# EAGLE design IGauge+V.2.0 (EAGLE 6.5.0)
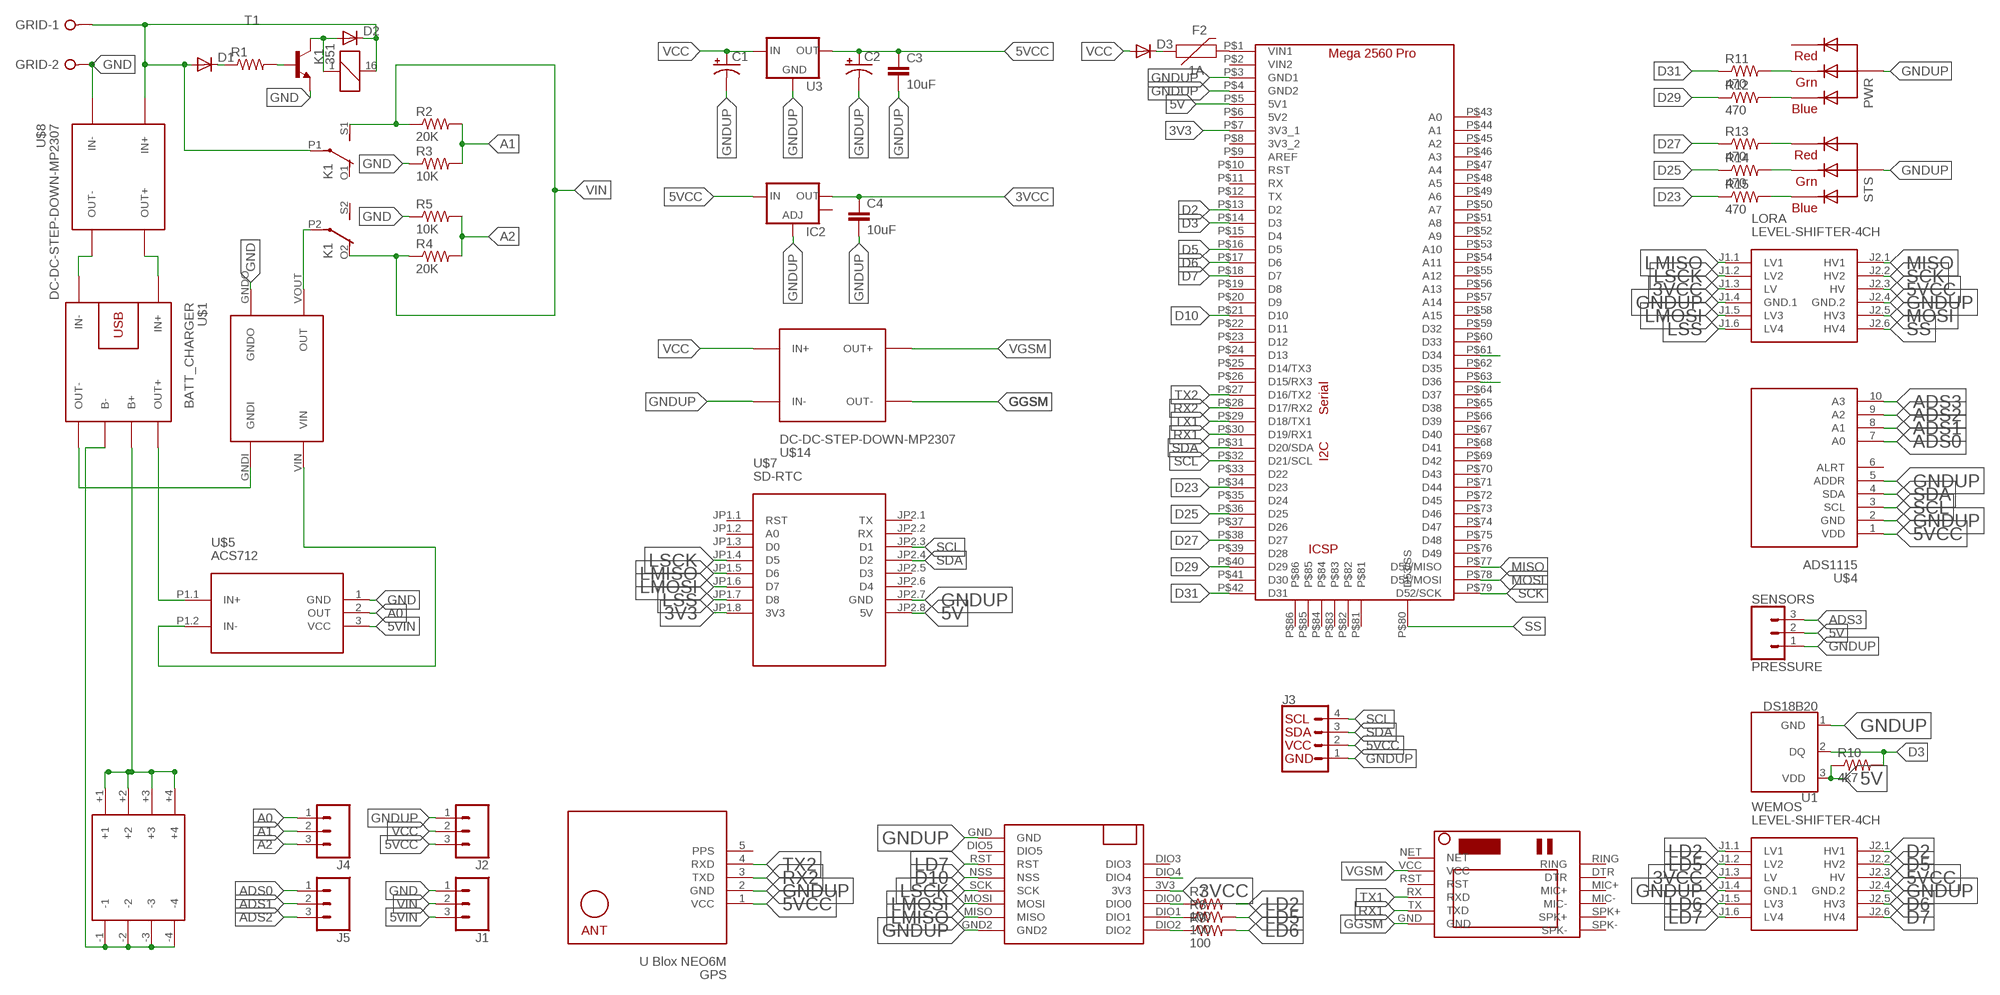
[diagram p0: schematic, sheet 1]

## Parts
C1  CPOL-USD  [PANASONIC_D]
C2  CPOL-USD  [PANASONIC_D]
C3  10uF  10UF-1206-6.3V-20%  [1206]
C4  10uF  10UF-1206-6.3V-20%  [1206]
D1  DIODE-SOD106A-R  [SOD106A-R]
D2  DIODE-SOD106A-R  [SOD106A-R]
D3  DIODE-SOD106A-R  [SOD106A-R]
F2  1A  PPTC_HALF-AMP  [1206]
GPS  U Blox NEO6M  GPS-RECEIVER-NEO6M  [GPS-RECEIVER-NEO6M]
GRID  W237-02P  [W237-132]
IC2  V_REG_LM1117SOT223  [SOT223]
J1  CONN_03  [1X03]
J2  CONN_03  [1X03]
J3  I2C_STANDARD  [1X04]
J4  CONN_03  [1X03]
J5  CONN_03  [1X03]
K1  351  [351]
LORA  LEVEL-SHIFTER-4CH  [LEVEL-SHIFTER-4CH]
PWR  RGBLED_CA-5MM  [LED5MMRGB]
R1  R-US_R1206  [R1206]
R2  20K  R-US_R1206  [R1206]
R3  10K  R-US_R1206  [R1206]
R4  20K  R-US_R1206  [R1206]
R5  10K  R-US_R1206  [R1206]
R7  100  R-US_M1406  [M1406]
R8  100  R-US_M1406  [M1406]
R9  100  R-US_M1406  [M1406]
R10  4k7  R-US_M1406  [M1406]
R11  470  R-US_R1206  [R1206]
R12  470  R-US_R1206  [R1206]
R13  470  R-US_R1206  [R1206]
R14  470  R-US_R1206  [R1206]
R15  470  R-US_R1206  [R1206]
SENSORS  PRESSURE  CONN_03POLAR  [MOLEX-1X3]
STS  RGBLED_CA-5MM  [LED5MMRGB]
T1  -NPN-SOT23-EBC  [SOT23-EBC]
U1  DS18B20  [TO-92-AMMO]
U3  V_REG_78XX-TO-220  [TO-220-ALT]
U$1  BATT_CHARGER  BATTERY-CHARGER-LI-PROT  [BATTERY-CHARGER-LI-PROT]
U$2  MT360_STEPUP  [MT360_STEPUP]
U$3  MEGAPROMINI  [MEGAPROMINI]
U$4  ADS1115  ADC-4CH-ADS1115  [ADC-4CH-ADS1115]
U$5  ACS712  CURRENT-SENSOR-ACS712#IC  [CURRENT-SENSOR-ACS712#IC]
U$6  LORA915MHZ  [LORA915MHZ]
U$7  SD-RTC  WEMOS-D1-MINI-SHIELD  [WEMOS-D1-MINI-SHIELD]
U$8  DC-DC-STEP-DOWN-MP2307  [DC-DC-STEP-DOWN-MP2307]
U$9  18650_4PCS_BATTERY_HOLDER  [18650_4PCS_BATTERY_HOLDER]
U$10  SIM800LMODULE  [SIM800LMODULE]
U$14  DC-DC-STEP-DOWN-MP2307  [DC-DC-STEP-DOWN-MP2307]
WEMOS  LEVEL-SHIFTER-4CH  [LEVEL-SHIFTER-4CH]

## Nets
3V3: U$3.P$7(3V3_1) U$7.JP1.8(3V3)
3VCC: C4.1 IC2.2(OUT) LORA.J1.3(LV) U$6.3V3 WEMOS.J1.3(LV)
5V: R10.1 SENSORS.2 U1.3(VDD) U$3.P$5(5V1) U$7.JP2.8(5V)
5VCC: C2.+ C3.1 GPS.1(VCC) IC2.3(IN) J2.3 J3.2 LORA.J2.3(HV) U3.OUT U$4.1(VDD) WEMOS.J2.3(HV)
5VIN: J1.3 U$5.3(VCC)
A0: J4.1 U$5.2(OUT)
A1: J4.2 R2.2 R3.2
A2: J4.3 R4.2 R5.2
ADS0: J5.1 U$4.7(A0)
ADS1: J5.2 U$4.8(A1)
ADS2: J5.3 U$4.9(A2)
ADS3: SENSORS.3 U$4.10(A3)
D2: U$3.P$13(D2) WEMOS.J2.1(HV1)
D3: R10.2 U1.2(DQ) U$3.P$14(D3)
D5: U$3.P$16(D5) WEMOS.J2.2(HV2)
D6: U$3.P$17(D6) WEMOS.J2.5(HV3)
D7: U$3.P$18(D7) WEMOS.J2.6(HV4)
D10: U$3.P$21(D10) U$6.NSS
D23: R15.1 U$3.P$34(D23)
D25: R14.1 U$3.P$36(D25)
D27: R13.1 U$3.P$38(D27)
D29: R12.1 U$3.P$40(D29)
D31: R11.1 U$3.P$42(D31)
D34: U$3.P$61(D34)
D36: U$3.P$63(D36)
GGSM: U$10.GND U$14.OUT-
GND: D1.A D2.C GRID.1 GRID.2 J1.1 K1.16 K1.P1(2:P) R3.1 R5.1 T1.E U$2.GNDO U$5.1(GND) U$8.IN+ U$8.IN-
GNDUP: C1.- C2.- C3.2 C4.2 GPS.2(GND) IC2.1(ADJ) J2.1 J3.1 LORA.J1.4(GND.1) LORA.J2.4(GND.2) PWR.2(VCC) SENSORS.1 STS.2(VCC) U1.1(GND) U3.GND U$1.IN- U$3.P$3(GND1) U$3.P$4(GND2) U$4.2(GND) U$4.5(ADDR) U$6.GND U$6.GND2 U$7.JP2.7(GND) U$8.OUT- U$14.IN- WEMOS.J1.4(GND.1) WEMOS.J2.4(GND.2)
LD2: R7.2 WEMOS.J1.1(LV1)
LD5: R8.2 WEMOS.J1.2(LV2)
LD6: R9.2 WEMOS.J1.5(LV3)
LD7: U$6.RST WEMOS.J1.6(LV4)
LMISO: LORA.J1.1(LV1) U$6.MISO U$7.JP1.5(D6)
LMOSI: LORA.J1.5(LV3) U$6.MOSI U$7.JP1.6(D7)
LSCK: LORA.J1.2(LV2) U$6.SCK U$7.JP1.4(D5)
LSS: LORA.J1.6(LV4) U$7.JP1.7(D8)
MISO: LORA.J2.1(HV1) U$3.P$77(D50/MISO)
MOSI: LORA.J2.5(HV3) U$3.P$78(D51/MOSI)
N$1: U$1.OUT- U$2.GNDI
N$2: D1.C R1.1
N$4: PWR.3(GREEN) R11.2
N$5: F2.2 U$3.P$1(VIN1)
N$6: D3.C F2.1
N$7: U$1.OUT+ U$5.P1.1(IN+)
N$9: U$1.IN+ U$8.OUT+
N$12: PWR.4(BLUE) R12.2
N$13: R13.2 STS.1(RED)
N$14: R1.2 T1.B
N$15: D2.A K1.1 T1.C
N$16: U$1.B+ U$9.+1 U$9.+2 U$9.+3 U$9.+4
N$17: U$1.B- U$9.-1 U$9.-2 U$9.-3 U$9.-4
N$19: R14.2 STS.3(GREEN)
N$20: R15.2 STS.4(BLUE)
N$21: U$6.DIO4
N$22: K1.P2(3:P) U$2.VOUT(OUT)
N$23: R7.1 U$6.DIO0
N$24: R8.1 U$6.DIO1
N$25: R9.1 U$6.DIO2
RX1: U$3.P$30(D19/RX1) U$10.TX(TXD)
RX2: GPS.3(TXD) U$3.P$28(D17/RX2)
SCK: LORA.J2.2(HV2) U$3.P$79(D52/SCK)
SCL: J3.4 U$3.P$32(D21/SCL) U$4.3(SCL) U$7.JP2.3(D1)
SDA: J3.3 U$3.P$31(D20/SDA) U$4.4(SDA) U$7.JP2.4(D2)
SS: LORA.J2.6(HV4) U$3.P$80(D53/SS)
TX1: U$3.P$29(D18/TX1) U$10.RX(RXD)
TX2: GPS.4(RXD) U$3.P$27(D16/TX2)
VCC: C1.+ D3.A J2.2 U3.IN U$14.IN+
VCCIN: U$2.VIN U$5.P1.2(IN-)
VGSM: U$10.VCC U$14.OUT+
VIN: J1.2 K1.O2(3:O) K1.S1(2:S) R2.1 R4.1
Unconnected: IC2.4(OUT) K1.O1(2:O) K1.S2(3:S) PWR.1(RED) U$3.P$2(VIN2) U$3.P$6(5V2) U$3.P$8(3V3_2) U$3.P$9(AREF) U$3.P$10(RST) U$3.P$11(RX) U$3.P$12(TX) U$3.P$15(D4) U$3.P$19(D8) U$3.P$20(D9) U$3.P$22(D11) U$3.P$23(D12) U$3.P$24(D13) U$3.P$25(D14/TX3) U$3.P$26(D15/RX3) U$3.P$33(D22) U$3.P$35(D24) U$3.P$37(D26) U$3.P$39(D28) U$3.P$41(D30) U$3.P$43(A0) U$3.P$44(A1) U$3.P$45(A2) U$3.P$46(A3) U$3.P$47(A4) U$3.P$48(A5) U$3.P$49(A6) U$3.P$50(A7) U$3.P$51(A8) U$3.P$52(A9) U$3.P$53(A10) U$3.P$54(A11) U$3.P$55(A12) U$3.P$56(A13) U$3.P$57(A14) U$3.P$58(A15) U$3.P$59(D32) U$3.P$60(D33) U$3.P$62(D35) U$3.P$64(D37) U$3.P$65(D38) U$3.P$66(D39) U$3.P$67(D40) U$3.P$68(D41) U$3.P$69(D42) U$3.P$70(D43) U$3.P$71(D44) U$3.P$72(D45) U$3.P$73(D46) U$3.P$74(D47) U$3.P$75(D48) U$3.P$76(D49) U$3.P$81 U$3.P$82 U$3.P$83 U$3.P$84 U$3.P$85 U$3.P$86 U$4.6(ALRT) U$6.DIO3 U$6.DIO5 U$7.JP1.1(RST) U$7.JP1.2(A0) U$7.JP1.3(D0) U$7.JP2.1(TX) U$7.JP2.2(RX) U$7.JP2.5(D3) U$7.JP2.6(D4) U$10.DTR U$10.MIC+ U$10.MIC- U$10.NET U$10.RING U$10.RST U$10.SPK+ U$10.SPK-

## Power pins joined to a net without a drawn wire
PPS: GPS.5(PPS)

## Library data of the parts
C1 C2 = resistor:CPOL-US: POLARIZED CAPACITOR, American symbol
C3 C4 = SparkFun-Capacitors:10UF: 10.0µF ceramic capacitors A capacitor is a passive two-terminal electrical component used to store electrical energy temporarily in an electric field.; PROD_ID: CAP-10057
D1-D3 = diode:DIODE-: DIODE
F2 = SparkFun-Fuses:PPTC: Resettable Fuse PPTC Resettable Fuse. Really a sort of resistor with a polymeric positive temperature coefficient whose resistance increases dramatically with an increase in temperature. When heated by the power passing through the resistance rises causing the current to be limited, protecting the circuit. This is achieved by the transition of the polymer from a crystalline to an amorphous state where the conductive carbon separates breaking the conductive pathways found in the cool crystalline structure. When a PPTC cools back down it resumes conducting letting the circuit turn back on. SparkFun Products: SparkFun RedBoard - Programmed with Arduino <https://www.sparkfun.com/products/12757> Pro Micro - 5V/16MHz <https://www.sparkfun.com/products/12640> Arduino Pro 328 - 5V/16MHz <https://www.sparkfun.com/products/10915> MP3 Trigger <https://www.sparkfun.com/products/13720>; PROD_ID: RES-08585; VALUE: 6V/0.5A
GPS = diy-modules:GPS-RECEIVER-NEO6M: GPS Receiver Module based on NEO-6 device Short tutorial how to use NEO-6 module with Arduino: http://www.xarg.org/2016/06/neo6mv2-gps-module-with-arduino/ NEO-6 datasheet is available here: https://www.u-blox.com/sites/default/files/products/documents/NEO-6_DataSheet_%28GPS.G6-HW-09005%29.pdf Click here to find device on ebay.com <http://www.ebay.com/sch/gyneo6mv2>
GRID = con-wago-508:W237-02P: WAGO SREW CLAMP; OC_FARNELL: unknown; OC_NEWARK: unknown
IC2 = SparkFun-3-2-07:V_REG_LM1117: Voltage Regulator LM1117 Standard adjustable voltage regulator but in SMD form. Spark Fun Electronics SKU : IC-LM1117
J1 J2 J4 J5 = SparkFun-Connectors:CONN_03: Multi connection point. Often used as Generic Header-pin footprint for 0.1 inch spaced/style header connections On any of the 0.1 inch spaced packages, you can populate with these: Break Away Headers - Straight <https://www.sparkfun.com/products/116> (PRT-00116) Break Away Male Headers - Right Angle <https://www.sparkfun.com/products/553> (PRT-00553) Female Headers <https://www.sparkfun.com/products/115> (PRT-00115) Break Away Headers - Machine Pin <https://www.sparkfun.com/products/117> (PRT-00117) Break Away Female Headers - Swiss Machine Pin <https://www.sparkfun.com/products/743> (PRT-00743) Stackable Header - 3 Pin (Female, 0.1") <https://www.sparkfun.com/products/13875> (PRT-13875) For SCREWTERMINALS and SPRING TERMINALS visit here: Screw Terimnals on SparkFun.com <https://www.sparkfun.com/search/results?term=Screw+Terminals> (5mm/3.5mm/2.54mm spacing) This device is also useful as a general connection point to wire up your design to another part of your project. Our various solder wires solder well into these plated through hole pads. Hook-Up Wire - Assortment (Stranded, 22 AWG) <https://www.sparkfun.com/products/11375> (PRT-11375) Hook-Up Wire - Assortment (Solid Core, 22 AWG) <https://www.sparkfun.com/products/11367> (PRT-11367) View the entire wire category on our website here <https://www.sparkfun.com/categories/141> Special notes: Molex polarized connector foot print use with SKU : PRT-08232 with associated crimp pins and housings.
J3 = SparkFun-Connectors:I2C_STANDARD: SparkFun I2C Standard Pinout Header SparkFun has standardized on a pinout for all I2C based sensor breakouts. This pinout allows I2C boards to be plugged directly into the headers on Arduino Uno compatible boards, and to be daisy chained easily. Example SparkFun Products: SparkFun Atmospheric Sensor Breakout - BME280 <https://www.sparkfun.com/products/13676> SparkFun Altitude/Pressure Sensor Breakout - MPL3115A2 <https://www.sparkfun.com/products/11084> SparkFun TOF Range Finder Sensor - VL6180 <https://www.sparkfun.com/products/12785>
K1 = relay:351: RELAY 2 x switch, Omron; OC_FARNELL: unknown; OC_NEWARK: unknown
LORA WEMOS = diy-modules:LEVEL-SHIFTER-4CH: 4-Channel Bi-Directional Logic Level Converter based on BSS128 transistors Click here to find device on ebay.com <http://www.ebay.com/sch/i2c+logic+converter+module>
PWR STS = adafruit:RGBLED_CA: RGB LED, common-anode 5MM Staggered pins 5mm Piranha package http://www.ladyada.net/library/pcb/eaglelibrary.html
R1-R5 R11-R15 = resistor:R-US_: RESISTOR, American symbol
R7-R10 = adafruit:R-US_: RESISTOR, American symbol
SENSORS = SparkFun-Connectors:CONN_03: Multi connection point. Often used as Generic Header-pin footprint for 0.1 inch spaced/style header connections On any of the 0.1 inch spaced packages, you can populate with these: Break Away Headers - Straight <https://www.sparkfun.com/products/116> (PRT-00116) Break Away Male Headers - Right Angle <https://www.sparkfun.com/products/553> (PRT-00553) Female Headers <https://www.sparkfun.com/products/115> (PRT-00115) Break Away Headers - Machine Pin <https://www.sparkfun.com/products/117> (PRT-00117) Break Away Female Headers - Swiss Machine Pin <https://www.sparkfun.com/products/743> (PRT-00743) Stackable Header - 3 Pin (Female, 0.1") <https://www.sparkfun.com/products/13875> (PRT-13875) For SCREWTERMINALS and SPRING TERMINALS visit here: Screw Terimnals on SparkFun.com <https://www.sparkfun.com/search/results?term=Screw+Terminals> (5mm/3.5mm/2.54mm spacing) This device is also useful as a general connection point to wire up your design to another part of your project. Our various solder wires solder well into these plated through hole pads. Hook-Up Wire - Assortment (Stranded, 22 AWG) <https://www.sparkfun.com/products/11375> (PRT-11375) Hook-Up Wire - Assortment (Solid Core, 22 AWG) <https://www.sparkfun.com/products/11367> (PRT-11367) View the entire wire category on our website here <https://www.sparkfun.com/categories/141> Special notes: Molex polarized connector foot print use with SKU : PRT-08232 with associated crimp pins and housings.; PROD_ID: CONN-08625; SF_ID: PRT-08096
T1 = transistor:*-NPN-: NPN Transistror BF959 corrected 2008.03.06
U1 = SparkFun-Sensors:DS18B20: Dallas/Maxim DS18B20 1-Wire Temperature Sensor The DS18B20 reports degrees C with 9 to 12-bit precision, -55C to 125C (+/-0.5C). Each sensor has a unique 64-Bit Serial number etched into it - allows for a huge number of sensors to be used on one data bus. Datasheet <http://datasheets.maximintegrated.com/en/ds/DS18B20.pdf> SparkFun Products One Wire Digital Temperature Sensor - DS18B20 <https://www.sparkfun.com/products/245> (SEN-00245); STORE_ID: SEN-00245
U3 = SparkFun-IC-Power:V_REG_78XX: Voltage Regulator Standard 78xx regulator. IGO (Input Ground Output). Spark Fun Electronics SKU : COM-00107; PROD_ID: VREG-08450; SF_ID: COM-00107
U$1 = diy-modules:BATTERY-CHARGER-LI-PROT: Lithium Battery 5V Charger with protection circuit More details available here: http://www.instructables.com/id/DIY-Lithium-ion-Battery-Charger/step4/TP4056-based-lithium-ion-battery-charger-module/ Click here to find device on ebay.com <http://www.ebay.com/sch/tp4056+charger+usb+protection>
U$2 = MT360_STEPUP:MT360_STEPUP
U$3 = MEGAPROMINI:MEGAPROMINI
U$4 = diy-modules:ADC-4CH-ADS1115: 4 Channel 16-Bit Analog-to-Digital Converter based on ADS1115 chip Arduino ADS1115 Getting Started Tutorial is available here: http://henrysbench.capnfatz.com/henrys-bench/arduino-voltage-measurements/arduino-ads1115-module-getting-started-tutorial/ ADS1115 datasheet is available here: http://www.ti.com/lit/ds/symlink/ads1115.pdf Click here to find device on ebay.com <http://www.ebay.com/sch/ads1115+module>
U$5 = diy-modules:CURRENT-SENSOR-ACS712#IC: Isolated Bipolar Current Sensors based on ACS712 chip Symbol with input pins More details available here: http://embedded-lab.com/blog/a-brief-overview-of-allegro-acs712-current-sensor-part-1/ Click here to find device on ebay.com <http://www.ebay.com/sch/acs712+module> Note: There are many available versions with different pinout. Please check before use
U$6 = LORA915MHZ:LORA915MHZ
U$7 = diy-modules:WEMOS-D1-MINI-SHIELD: Template for WEMOS D1 mini compatible shields NOTICE: This is a template only. You can use it as a base to create symbols for WEMOS D1 mini compatible shields. Official list of available shields can be found here: https://www.wemos.cc/D1-mini-Shields
U$8 U$14 = diy-modules:DC-DC-STEP-DOWN-MP2307: DC/DC Step-Down Regulator based on MP2307DN chip MP2307 datasheet available here: https://cdn-shop.adafruit.com/datasheets/MP2307_r1.9.pdf Click here to find device on ebay.com <http://www.ebay.com/sch/dc+dc+3a+mini+converter>
U$9 = 18650-Battery-Holder:18650_4PCS_BATTERY_HOLDER
U$10 = SIM800LMODULE:SIM800LMODULE: SIM800L Module

## Board
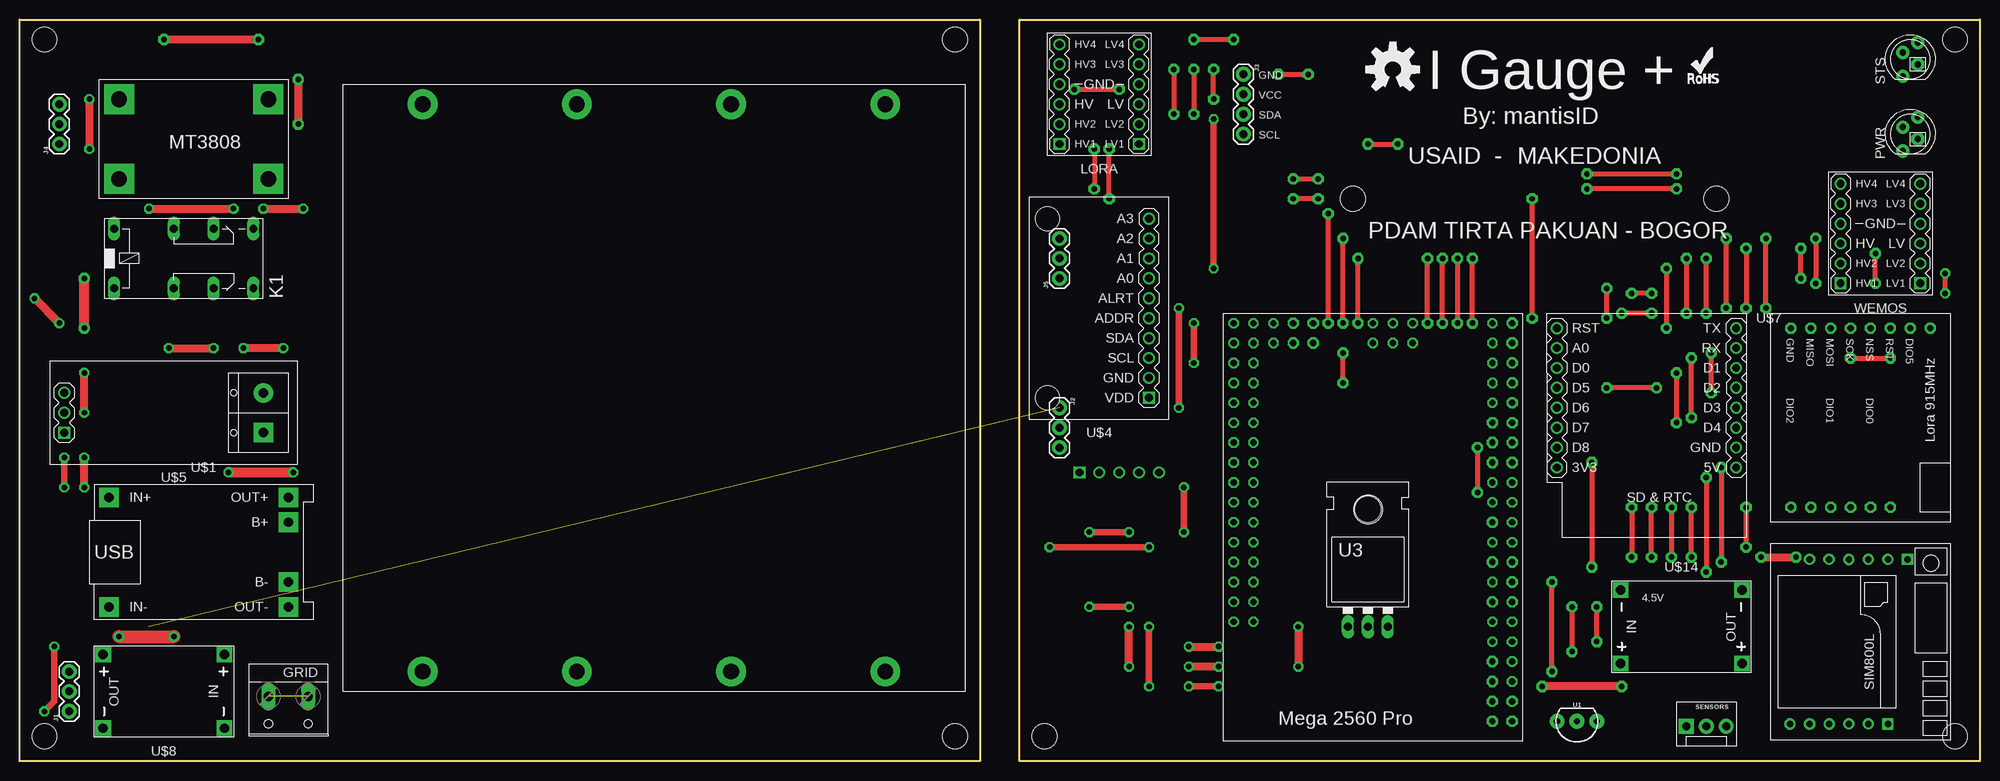
[diagram p1: board, top side]
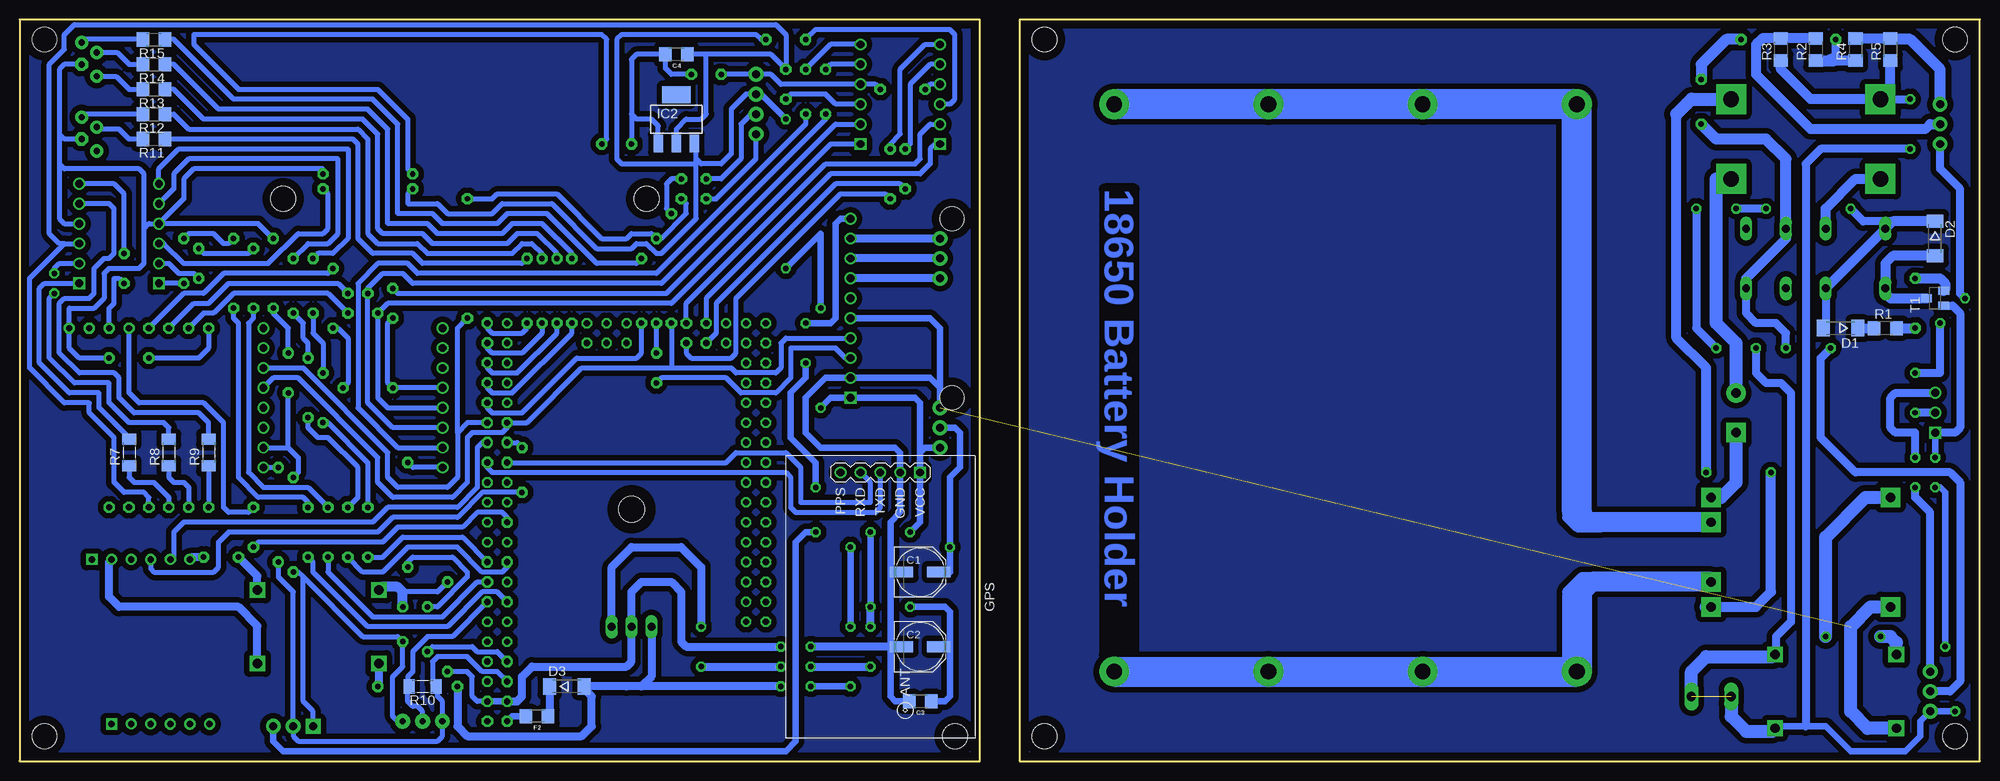
[diagram p2: board, bottom side, seen from below]

Size 250.19 x 94.62 mm. Coordinates in mm from the lower left corner, seen from the top.
Outline: 122.56,94.62 122.56,0 0,0 0,94.62 122.56,94.62
Outline: 127.64,0 127.64,94.62 250.19,94.62 250.19,0 127.64,0
Copper layers (1*16): Top 0.035mm / dielectric 1.5mm / Bottom 0.035mm
Design rules "default *": minimum track width 10mil, minimum drill 24mil, track to track 28mil, track to pad 28mil, pad to pad 28mil, via to via 28mil, smd to smd 28mil, copper to edge 40mil, drill to drill 8mil, minimum pad ring 10mil, minimum via ring 8mil, stop-mask expansion 4mil, vias tented up to drill 0mil, thermal gap 10mil
Holes 3.2 mm at 247.01,3.17 130.81,3.17 216.53,71.76 170.18,71.76 3.17,3.17 119.38,3.17 119.38,92.08 3.17,92.08 247.01,92.08

### Footprints (pad centres in the part's own frame; a part is rotated, then mirrored left to right if it is on the bottom)
PANASONIC_D = smd 3 x 1.4: + 2.4,0; - -2.4,0
1206 = smd 1.6 x 1.8: 1 -1.4,0; 2 1.4,0
SOD106A-R = smd 1.7 x 2.1: A 2.2,0; C -2.2,0
GPS-RECEIVER-NEO6M = drill 1 square: 1 -15.875,5.08 | drill 1: 2 -15.875,2.54; 3 -15.875,0; 4 -15.875,-2.54; 5 -15.875,-5.08
W237-132 = drill 1.194 long: 1 -2.54,-0.635; 2 2.54,-0.635
SOT223 = smd 1.219 x 2.235: 1 -2.311,-3.099; 2 0,-3.099; 3 2.311,-3.099 | smd 3.6 x 2.2: 4 0,3.099
1X03 = drill 1.016 pad 1.88: 1 0,0; 2 2.54,0; 3 5.08,0
1X04 = drill 1.016 pad 1.88: 1 0,0; 2 2.54,0; 3 5.08,0; 4 7.62,0
351 = drill 1.016 long: 1 -3.81,-3.81; 16 -3.81,3.81; O1 8.89,-3.81; O2 8.89,3.81; P1 3.81,-3.81; P2 3.81,3.81; S1 13.97,-3.81; S2 13.97,3.81
LEVEL-SHIFTER-4CH = drill 1 square: J1.1 -5.08,6.35; J2.1 5.08,6.35 | drill 1: J1.2 -5.08,3.81; J1.3 -5.08,1.27; J1.4 -5.08,-1.27; J1.5 -5.08,-3.81; J1.6 -5.08,-6.35; J2.2 5.08,3.81; J2.3 5.08,1.27; J2.4 5.08,-1.27; J2.5 5.08,-3.81; J2.6 5.08,-6.35
LED5MMRGB = drill 0.8 pad 1.676: 1 -2.159,0.968; 3 0.889,0.968; 4 2.159,-0.968 | drill 0.8 pad 1.676 octagon: 2 -0.635,-0.968
R1206 = smd 1.6 x 1.803: 1 -1.422,0; 2 1.422,0
M1406 = smd 1.4 x 1.8: 1 -1.7,0; 2 1.7,0
MOLEX-1X3 = drill 1.016 pad 1.88 square: 1 0,0 | drill 1.016 pad 1.88: 2 2.54,0; 3 5.08,0
SOT23-EBC = smd 1 x 1.4: B 0.95,-1.1; C 0,1.1; E -0.95,-1.1
TO-92-AMMO = drill 0.813 pad 1.88: 1 -2.54,0; 2 0,0; 3 2.54,0
TO-220-ALT = drill 1.016 long: GND 0,-3.81; IN -2.54,-3.81; OUT 2.54,-3.81 | hole 3.302: 0,11.176
BATTERY-CHARGER-LI-PROT = drill 1.2 pad 2.5 square: B+ 10.795,3.81; B- 10.795,-3.81; IN+ -12.065,6.985; IN- -12.065,-6.985; OUT+ 10.795,6.985; OUT- 10.795,-6.985
MT360_STEPUP = drill 2 pad 3.81 square: GNDI 3.81,-2.54; GNDO 3.81,-21.59; VIN 13.97,-2.54; VOUT 13.97,-21.59
MEGAPROMINI = drill 0.8 octagon: P$1 3.81,-2.54; P$2 1.27,-2.54; P$3 3.81,-5.08; P$4 1.27,-5.08; P$5 3.81,-7.62; P$6 1.27,-7.62; P$7 3.81,-10.16; P$8 1.27,-10.16; P$9 3.81,-12.7; P$10 1.27,-12.7; P$11 3.81,-15.24; P$12 1.27,-15.24; P$13 3.81,-17.78; P$14 1.27,-17.78; P$15 3.81,-20.32; P$16 1.27,-20.32; P$17 3.81,-22.86; P$18 1.27,-22.86; P$19 3.81,-25.4; P$20 1.27,-25.4; P$21 3.81,-27.94; P$22 1.27,-27.94; P$23 3.81,-30.48; P$24 1.27,-30.48; P$25 3.81,-33.02; P$26 1.27,-33.02; P$27 3.81,-35.56; P$28 1.27,-35.56; P$29 3.81,-38.1; P$30 1.27,-38.1; P$31 3.81,-40.64; P$32 1.27,-40.64; P$33 3.81,-43.18; P$34 1.27,-43.18; P$35 3.81,-45.72; P$36 1.27,-45.72; P$37 3.81,-48.26; P$38 1.27,-48.26; P$39 3.81,-50.8; P$40 1.27,-50.8; P$41 3.81,-53.34; P$42 1.27,-53.34; P$43 36.83,-15.24; P$44 34.29,-15.24; P$45 36.83,-17.78; P$46 34.29,-17.78; P$47 36.83,-20.32; P$48 34.29,-20.32; P$49 36.83,-22.86; P$50 34.29,-22.86; P$51 36.83,-25.4; P$52 34.29,-25.4; P$53 36.83,-27.94; P$54 34.29,-27.94; P$55 36.83,-30.48; P$56 34.29,-30.48; P$57 36.83,-33.02; P$58 34.29,-33.02; P$59 36.83,-35.56; P$60 34.29,-35.56; P$61 36.83,-38.1; P$62 34.29,-38.1; P$63 36.83,-40.64; P$64 34.29,-40.64; P$65 36.83,-43.18; P$66 34.29,-43.18; P$67 36.83,-45.72; P$68 34.29,-45.72; P$69 36.83,-48.26; P$70 34.29,-48.26; P$71 36.83,-50.8; P$72 34.29,-50.8; P$73 36.83,-53.34; P$74 34.29,-53.34; P$75 31.75,-53.34; P$76 31.75,-50.8; P$77 29.21,-53.34; P$78 29.21,-50.8; P$79 26.67,-53.34; P$80 26.67,-50.8; P$81 19.05,-53.34; P$82 19.05,-50.8; P$83 16.51,-53.34; P$84 16.51,-50.8; P$85 13.97,-53.34; P$86 13.97,-50.8
ADC-4CH-ADS1115 = drill 1 square: 1 -6.35,11.43 | drill 1: 2 -6.35,8.89; 3 -6.35,6.35; 4 -6.35,3.81; 5 -6.35,1.27; 6 -6.35,-1.27; 7 -6.35,-3.81; 8 -6.35,-6.35; 9 -6.35,-8.89; 10 -6.35,-11.43 | hole 3.1: 6.604,11.43; 6.604,-11.43
CURRENT-SENSOR-ACS712#IC = drill 1 square: 1 13.97,2.54 | drill 1: 2 13.97,0; 3 13.97,-2.54 | drill 1.2 pad 2.5 square: P1.1 -11.43,2.54 | drill 1.2 pad 2.5: P1.2 -11.43,-2.54
LORA915MHZ = drill 0.8 octagon: 3V3 24.765,-12.7; DIO0 24.765,-15.24; DIO1 24.765,-17.78; DIO2 24.765,-20.32; DIO3 24.765,-7.62; DIO4 24.765,-10.16; DIO5 1.905,-5.08; GND 1.905,-2.54; GND2 1.905,-20.32; MISO 1.905,-17.78; MOSI 1.905,-15.24; NSS 1.905,-10.16; RST 1.905,-7.62; SCK 1.905,-12.7
WEMOS-D1-MINI-SHIELD = drill 1: JP1.1 -11.43,12.065; JP1.2 -11.43,9.525; JP1.3 -11.43,6.985; JP1.4 -11.43,4.445; JP1.5 -11.43,1.905; JP1.6 -11.43,-0.635; JP1.7 -11.43,-3.175; JP1.8 -11.43,-5.715; JP2.1 11.43,12.065; JP2.2 11.43,9.525; JP2.3 11.43,6.985; JP2.4 11.43,4.445; JP2.5 11.43,1.905; JP2.6 11.43,-0.635; JP2.7 11.43,-3.175; JP2.8 11.43,-5.715
DC-DC-STEP-DOWN-MP2307 = drill 1.2 pad 2 square: IN+ -7.747,-4.699; IN- -7.747,4.699; OUT+ 7.747,-4.699; OUT- 7.747,4.699
18650_4PCS_BATTERY_HOLDER = drill 2 pad 3.81: +1 10.16,74.93; +2 29.845,74.93; +3 49.53,74.93; +4 69.215,74.93; -1 10.16,2.54; -2 29.845,2.54; -3 49.53,2.54; -4 69.215,2.54
SIM800LMODULE = drill 0.8: DTR 10.5,1; GND -10.5,-6.5; MIC+ 10.5,-1.5; MIC- 10.5,-4; RST -10.5,1; RX -10.5,-1.5; SPK+ 10.5,-6.5; SPK- 10.5,-9; TX -10.5,-4; VCC -10.5,3.5 | drill 0.8 square: NET -10.5,6; RING 10.5,3.5

### Placement (x,y rotation side)
C1  135.25,24.13 0 bottom
C2  135.25,14.61 0 bottom
C3  135.25,7.62 180 bottom
C4  166.37,90.17 180 bottom
D1  17.78,55.24 180 bottom
D2  5.72,66.68 270 bottom
D3  180.34,9.53 0 bottom
F2  184.15,5.71 180 bottom
GPS  140.34,20.96 270 bottom
GRID  34.29,7.62 180 top
IC2  166.37,81.92 0 bottom
J1  6.35,6.35 90 top
J2  132.72,45.09 270 top
J3  156.21,87.63 270 top
J4  5.08,78.74 90 top
J5  132.72,61.59 90 top
K1  15.88,64.14 0 top
LORA  137.8,85.09 180 top
PWR  241.3,80.01 90 top
R1  12.06,55.24 0 bottom
R2  20.95,90.81 90 bottom
R3  25.4,90.81 90 bottom
R4  15.88,90.81 90 bottom
R5  11.43,90.81 90 bottom
R7  236.22,39.37 90 bottom
R8  231.14,39.37 90 bottom
R9  226.06,39.37 90 bottom
R10  198.75,9.53 180 bottom
R11  233.05,79.38 180 bottom
R12  233.05,82.55 180 bottom
R13  233.05,85.73 180 bottom
R14  233.05,88.9 180 bottom
R15  233.05,92.08 180 bottom
SENSORS  212.72,4.45 0 top
STS  241.3,89.54 90 top
T1  5.72,59.05 90 bottom
U1  198.75,5.08 180 top
U3  172.08,20.96 0 top
U$1  23.5,26.67 0 top
U$2  34.29,88.27 270 top
U$3  191.77,2.54 180 top
U$4  137.8,57.78 180 top
U$5  19.69,44.45 180 top
U$6  246.38,57.15 270 top
U$7  207.64,43.18 0 top
U$8  18.42,8.89 180 top
U$9  41.27,8.89 0 top
U$10  234.95,15.24 270 top
U$12  [OSHW-LOGO-L]  175.26,88.27 0 top
U$13  [ROHS_LOGO_0.18_IN]  212.72,86.36 0 top
U$14  212.09,17.15 0 top
WEMOS  237.49,67.31 180 top

### Tracks (layer width: path | path; a pad name or v marks a point on that pad's centre or on a via)
3V3  (via drill 0.7 pad 1.42)
  Top 0.61: v200.66,38.1 v200.66,24.77 | v198.12,19.69 v198.12,13.97
  Bottom 0.61: U$7.JP1.8 200.03,37.46 v200.66,38.1 | v200.66,24.77 200.66,25.4 200.03,26.04 194.94,26.04 193.04,24.13 193.04,23.5 196.85,19.69 v198.12,19.69 | v198.12,13.97 197.49,14.61 192.41,14.61 191.77,13.97 189.23,13.97 U$3.P$7
3VCC  (via drill 0.7 pad 1.42)
  Top 0.61: v152.4,84.45 v152.4,88.27
  Bottom 0.61: LORA.J1.3 146.05,83.82 147.32,85.09 151.76,85.09 v152.4,84.45 | IC2.2 166.37,80.65 165.1,81.92 163.19,81.92 162.56,82.55 162.56,90.17 | U$6.3V3 233.68,33.66 234.31,34.29 236.86,34.29 238.12,35.56 238.12,41.27 241.3,44.45 241.3,45.72 244.48,45.72 248.92,50.16 248.92,61.59 244.48,66.04 | 162.56,90.17 154.31,90.17 v152.4,88.27 152.4,92.71 153.67,93.98 243.2,93.98 244.48,92.71 244.48,90.81 246.38,88.9 246.38,67.31 245.11,66.04 244.48,66.04 | 162.56,90.17 C4.1 | 244.48,66.04 WEMOS.J1.3
5V  (via drill 0.7 pad 1.42)
  Top 0.61: v217.17,37.46 v217.17,25.4
  Bottom 0.61: U$7.JP2.8 v217.17,37.46 | v217.17,25.4 217.17,23.5 215.26,21.59 SENSORS.2 215.26,3.17 214.63,2.54 196.85,2.54 196.22,3.17 U1.3 196.22,7.62 196.85,8.26 196.85,9.32 R10.1 197.49,9.96 197.49,12.7 196.85,13.33 193.04,13.33 191.13,11.43 189.23,11.43 U$3.P$5
5VCC  (via drill 0.7 pad 1.27, 0.7 pad 1.42)
  Top 0.61: v211.45,73.03 v200.03,73.03 | v149.86,92.08 v154.94,92.08
  Top 0.813: v136.53,19.69 v141.61,19.69 | v141.61,29.21 v136.53,29.21 | v147.95,45.09 v147.95,57.78 | v152.4,62.86 v152.4,81.92
  Top 1.016: v163.19,17.15 v163.19,12.06 | v153.03,12.06 v149.22,12.06 | v141.61,12.06 v141.61,17.15
  Bottom 0.61: WEMOS.J2.3 231.78,66.04 229.24,63.5 218.44,63.5 214.63,67.31 211.45,67.31 210.82,67.95 210.82,72.39 v211.45,73.03 | v200.03,73.03 200.66,72.39 200.66,71.12 196.85,71.12 195.58,69.85 189.87,69.85 188.59,71.12 182.25,71.12 176.53,65.41 172.08,65.41 171.45,66.04 170.18,66.04 168.91,64.77 168.28,64.77 163.83,69.22 163.83,76.2 | 163.83,76.2 163.83,76.84 | 163.83,76.84 163.83,78.59 IC2.3 | v149.86,92.08 148.59,93.34 131.44,93.34 130.81,92.71 130.81,84.45 131.44,83.82 LORA.J2.3 | v154.94,92.08 155.57,92.08 156.21,92.71 173.36,92.71 173.99,92.08 173.99,76.84 173.36,76.2 163.83,76.2 | J3.2 157.48,85.09 159.38,83.19 159.38,77.47 160.66,76.2 163.19,76.2 163.83,76.84
  Bottom 0.813: GPS.1 135.25,39.37 134.62,40 J2.3 | GPS.1 135.25,45.72 135.89,46.35 U$4.1 146.69,46.35 v147.95,45.09 | C2.+ 131.44,14.61 | 131.44,14.61 131.44,19.05 132.08,19.69 v136.53,19.69 | v141.61,19.69 v141.61,29.21 | v136.53,29.21 135.25,30.48 GPS.1 | C3.1 132.08,7.62 131.44,8.26 131.44,14.61 | v147.95,57.78 147.95,67.31 v152.4,62.86 | v152.4,81.92 155.57,85.09 J3.2
  Bottom 1.016: U3.OUT 174.62,24.77 172.08,27.31 165.74,27.31 163.19,24.77 v163.19,17.15 | v163.19,12.06 v153.03,12.06 | v149.22,12.06 v141.61,12.06 | v141.61,17.15 v141.61,19.69
5VIN  (via drill 0.7 pad 1.27)
  Top 1.016: v8.25,34.92 v8.25,38.73
  Bottom 1.016: J1.3 6.35,31.75 8.25,33.66 v8.25,34.92 | v8.25,38.73 8.25,41.91 10.8,41.91 11.43,42.54 11.43,46.35 10.8,46.99 U$5.3
A0  (via drill 0.7 pad 1.27)
  Top 1.016: v8.25,44.45 v8.25,49.53 | v5.08,55.88 v1.91,59.05
  Bottom 1.016: U$5.2 v8.25,44.45 | v8.25,49.53 5.08,49.53 v5.08,55.88 | v1.91,59.05 2.54,59.69 2.54,73.03 5.08,75.57 J4.1
A1
  Bottom 1.27: R3.2 R2.2 27.79,92.23 28.58,91.44 28.58,87.63 21.59,80.65 6.98,80.65 6.35,81.28 J4.2
A2
  Bottom 1.27: R4.2 R5.2
  Bottom 1.422: J4.3 5.08,88.27 8.89,92.08 11.28,92.08 R5.2
ADS0
  Bottom 1.016: J5.1 U$4.7
ADS1
  Bottom 1.016: J5.2 U$4.8
ADS2
  Bottom 1.016: J5.3 U$4.9
ADS3  (via drill 0.7 pad 1.27)
  Top 0.813: v148.59,29.21 v148.59,34.92 | v149.86,50.8 v149.86,55.88
  Bottom 0.813: v148.59,29.21 149.86,29.21 151.13,27.94 151.13,2.54 152.4,1.27 216.53,1.27 217.81,2.54 SENSORS.3 | v148.59,34.92 148.59,38.1 151.76,41.27 151.76,46.99 149.86,48.89 v149.86,50.8 | v149.86,55.88 146.69,55.88 146.05,56.52 146.05,68.58 145.41,69.22 U$4.10
D2  (via drill 0.7 pad 1.42)
  Top 0.61: v213.36,26.04 v213.36,32.38 | v222.88,57.78 v222.88,66.68 | v229.24,66.68 v229.24,60.96
  Bottom 0.61: U$3.P$13 189.23,21.59 191.13,21.59 195.58,17.15 205.74,17.15 212.72,24.13 212.72,25.4 v213.36,26.04 | v213.36,32.38 213.36,33.02 214,33.66 219.71,33.66 222.25,36.2 222.25,55.88 222.88,56.52 v222.88,57.78 | v222.88,66.68 223.52,66.04 224.16,66.04 225.43,67.31 228.6,67.31 v229.24,66.68 | v229.24,60.96 WEMOS.J2.1
D3
  Bottom 0.61: U1.2 198.75,6.35 199.39,6.98 200.03,6.98 200.66,7.62 200.66,9.32 R10.2 200.66,9.73 200.66,10.79 200.03,11.43 200.03,13.97 198.12,15.88 194.94,15.88 U$3.P$14
D5  (via drill 0.7 pad 1.42)
  Top 0.61: v227.33,61.59 v227.33,65.41 | v220.34,65.41 v220.34,57.78 | v210.82,32.38 v210.82,26.04
  Bottom 0.61: WEMOS.J2.2 231.14,63.5 229.87,62.23 227.97,62.23 v227.33,61.59 | v227.33,65.41 226.69,64.77 220.98,64.77 v220.34,65.41 | v220.34,57.78 220.34,56.52 220.98,55.88 220.98,36.83 219.07,34.92 213.36,34.92 v210.82,32.38 | v210.82,26.04 210.82,24.13 205.11,18.42 196.22,18.42 191.77,22.86 U$3.P$16
D6  (via drill 0.7 pad 1.42)
  Top 0.61: v208.28,26.04 v208.28,32.38 | v213.36,43.81 v213.36,51.43 | v215.26,57.15 v215.26,64.14
  Bottom 0.61: U$3.P$17 187.96,24.77 188.59,24.13 191.13,24.13 194.31,27.31 200.66,27.31 203.83,24.13 205.11,24.13 205.74,24.13 206.38,24.13 v208.28,26.04 | v208.28,32.38 207.01,33.66 207.01,37.46 210.82,41.27 212.09,41.27 213.36,42.54 v213.36,43.81 | v213.36,51.43 213.36,53.34 214,53.98 214,55.88 v215.26,57.15 | v215.26,64.14 213.36,66.04 210.82,66.04 209.55,67.31 209.55,76.84 228.6,76.84 230.5,74.93 230.5,73.03 WEMOS.J2.5
D7  (via drill 0.7 pad 1.42)
  Top 0.61: v212.72,64.14 v212.72,57.15 | v211.45,49.53 v211.45,43.18 | v205.74,32.38 v205.74,26.04
  Bottom 0.61: WEMOS.J2.6 232.41,75.57 229.87,78.11 208.28,78.11 208.28,66.68 210.19,64.77 212.09,64.77 v212.72,64.14 | v212.72,57.15 212.72,54.61 211.45,53.34 v211.45,49.53 | v211.45,43.18 210.82,43.18 205.74,38.1 v205.74,32.38 | v205.74,26.04 203.83,26.04 201.3,28.58 193.68,28.58 U$3.P$18
D10  (via drill 0.7 pad 1.42)
  Top 0.61: v220.34,27.31 v220.34,32.38
  Bottom 0.61: U$3.P$21 187.96,31.12 188.59,31.75 191.77,31.75 193.68,29.85 201.93,29.85 203.83,27.94 219.71,27.94 v220.34,27.31 | v220.34,32.38 220.98,31.75 223.52,31.75 224.16,32.38 224.16,43.18 226.69,45.72 234.95,45.72 236.22,46.99 U$6.NSS
D23  (via drill 0.7 pad 1.42)
  Top 0.61: v170.81,55.88 v170.81,64.14
  Bottom 0.61: U$3.P$34 190.5,45.09 189.87,44.45 186.06,44.45 179.07,51.43 171.45,51.43 170.81,52.07 v170.81,55.88 | v170.81,64.14 171.45,63.5 176.53,63.5 182.88,69.85 187.96,69.85 189.23,68.58 196.22,68.58 197.49,69.85 201.93,69.85 201.93,81.28 205.11,84.45 222.88,84.45 230.5,92.08 R15.1
D25  (via drill 0.7 pad 1.42)
  Top 0.61: v179.7,55.88 v179.7,64.14
  Bottom 0.61: U$3.P$36 190.5,47.62 189.87,46.99 187.32,46.99 179.7,54.61 v179.7,55.88 | v179.7,64.14 179.7,64.77 183.51,68.58 187.32,68.58 188.59,67.31 196.85,67.31 198.12,68.58 203.2,68.58 203.2,80.65 205.74,83.19 224.79,83.19 230.5,88.9 R14.1
D27  (via drill 0.7 pad 1.42)
  Top 0.61: v181.61,55.88 v181.61,64.14
  Bottom 0.61: U$3.P$38 190.5,50.16 189.87,49.53 186.69,49.53 181.61,54.61 v181.61,55.88 | v181.61,64.14 181.61,64.77 184.15,67.31 186.69,67.31 187.96,66.04 197.49,66.04 198.75,67.31 203.83,67.31 204.47,67.95 204.47,80.01 206.38,81.92 226.69,81.92 230.5,85.73 R13.1
D29  (via drill 0.7 pad 1.42)
  Top 0.61: v183.51,64.14 v183.51,55.88
  Bottom 0.61: R12.1 230.5,82.55 228.6,80.65 207.01,80.65 205.74,79.38 205.74,67.31 204.47,66.04 199.39,66.04 198.12,64.77 187.32,64.77 186.06,66.04 184.78,66.04 183.51,64.77 v183.51,64.14 | v183.51,55.88 183.51,54.61 186.06,52.07 189.87,52.07 190.5,52.7 U$3.P$40
D31  (via drill 0.7 pad 1.42)
  Top 0.61: v185.42,55.88 v185.42,64.14
  Bottom 0.61: U$3.P$42 190.5,55.24 189.87,54.61 186.06,54.61 185.42,55.24 v185.42,55.88 | v185.42,64.14 186.06,63.5 198.75,63.5 200.03,64.77 205.11,64.77 207.01,66.68 207.01,78.74 207.64,79.38 R11.1
GGSM  (via drill 0.7 pad 1.42)
  Top 1.016: v222.25,26.04 v226.69,26.04
  Bottom 1.016: U$14.OUT- 219.84,23.62 v222.25,26.04 | v226.69,26.04 228.16,26.04 U$10.GND
GND  (via drill 0.7 pad 1.27)  (1 unrouted)
  Top 0.813: v5.72,38.73 v5.72,34.92 | v4.45,14.61 4.45,7.62 v3.17,6.35
  Top 1.016: v8.89,84.45 v8.89,78.11 | v16.51,70.48 v27.31,70.48 | v31.11,70.48 v36.2,70.48 | v33.66,52.7 v28.58,52.7
  Bottom 0.813: U$8.IN- 25.91,4.45 22.22,4.45 19.69,4.45 16.51,1.27 9.53,1.27 7.62,3.17 7.62,5.08 J1.1 v3.17,6.35 | U$5.1 v5.72,38.73 | v5.72,34.92 5.08,34.92 4.45,34.29 v4.45,14.61
  Bottom 1.016: T1.E 3.5,58.1 2.54,57.15 2.54,42.54 3.17,41.91 U$5.1 | 12.06,84.45 v8.89,84.45 | K1.P1 19.69,55.54 D1.A | v8.89,78.11 20.32,78.11 22.22,76.2 22.22,4.45 | 11.14,68.88 14.9,68.88 v16.51,70.48 | v27.31,70.48 v31.11,70.48 | v36.2,70.48 36.2,55.24 v33.66,52.7 | v28.58,52.7 28.58,49.53 27.31,48.26 25.4,48.26 24.13,46.99 24.13,17.78 26.03,15.88 26.03,13.72 U$8.IN+
  Bottom 1.27: R5.1 11.43,85.09 12.06,84.45 U$2.GNDO 21.59,84.45 25.4,88.27 R3.1 | D2.C 11.14,68.88 K1.16 K1.P1
  Bottom 1.676: GRID.1 36.83,11.43 34.92,13.33 26.42,13.33 U$8.IN+ | GRID.2 31.75,5.71 29.84,3.81 26.54,3.81 U$8.IN-
GNDUP  (via drill 0.7 pad 1.27, 0.7 pad 1.42)  (1 unrouted)
  Top 0.61: v134.62,85.73 v140.34,85.73 | v160.66,87.63 v164.47,87.63 | v233.68,51.43 v238.76,51.43 | v215.26,36.2 v215.26,24.13 | v201.3,15.24 v201.3,19.69 | v215.9,46.99 v215.9,52.07 | v217.81,57.78 v217.81,66.68 | v172.08,78.74 v175.89,78.74 | v200.03,74.93 v211.45,74.93 | v195.58,11.43 v195.58,22.86
  Top 1.016: v149.22,14.61 v153.03,14.61
  Bottom 0.61: LORA.J2.4 133.99,86.36 v134.62,85.73 | v140.34,85.73 140.97,86.36 LORA.J1.4 153.03,86.36 154.31,87.63 J3.1 v160.66,87.63 | IC2.1 168.68,81.05 169.55,81.92 171.45,81.92 172.08,82.55 | v164.47,87.63 167,87.63 167.77,88.4 C4.2 171.45,90.17 172.08,89.54 172.08,82.55 | STS.2 244.48,88.9 245.11,88.27 245.11,80.01 | 234.31,67.95 234.31,63.5 234.95,62.86 238.76,62.86 239.39,62.23 239.39,59.05 240.67,57.78 243.84,57.78 U$6.GND 243.84,52.7 242.57,51.43 v238.76,51.43 | 234.31,67.95 233.68,68.58 WEMOS.J2.4 | PWR.2 244.48,79.38 245.11,80.01 | 245.11,80.01 245.11,76.2 | 245.11,76.2 245.11,69.22 244.48,68.58 WEMOS.J1.4 | 234.31,67.95 234.31,74.93 234.95,75.57 244.48,75.57 245.11,76.2 | U$6.GND2 226.06,52.7 227.33,51.43 v233.68,51.43 | v215.26,36.2 214.63,36.83 214.63,38.73 215.9,40 | v215.26,24.13 214.63,24.13 214,23.5 | 214,23.5 206.38,15.88 201.93,15.88 v201.3,15.24 201.3,12.06 202.56,10.79 202.56,5.71 201.93,5.08 U1.1 | SENSORS.1 212.72,6.35 214,7.62 214,23.5 | U$7.JP2.7 215.9,40 | 215.9,40 v215.9,46.99 | v215.9,52.07 215.9,55.24 217.81,57.15 v217.81,57.78 | v217.81,66.68 219.71,68.58 WEMOS.J2.4 | 172.08,82.55 v172.08,78.74 | v175.89,78.74 175.26,79.38 175.26,92.08 175.89,92.71 227.97,92.71 227.97,91.44 222.25,85.73 204.47,85.73 200.66,81.92 200.66,75.57 v200.03,74.93 | v211.45,74.93 211.45,75.57 227.97,75.57 229.24,74.3 229.24,71.76 WEMOS.J2.4 | U$3.P$4 191.77,7.62 192.41,8.26 192.41,10.79 193.04,11.43 v195.58,11.43 | v195.58,22.86 196.85,21.59 201.3,21.59
  Bottom 0.813: U$3.P$3 U$3.P$4 | 139.06,24.13 139.06,30.48 137.8,31.75 GPS.2 137.8,39.37 138.43,40 147.95,40 149.86,41.91 149.86,46.35 147.32,48.89 U$4.2 133.99,48.89 132.72,47.62 J2.1 132.72,55.24 133.99,56.52 U$4.5 | C1.- 139.06,24.13 | 139.06,24.13 139.06,14.61 | C2.- 139.06,14.61 | 139.06,14.61 139.06,8.26 138.43,7.62 C3.2
  Bottom 1.016: 139.06,14.61 v149.22,14.61 | v153.03,14.61 165.1,14.61 165.74,15.24 165.74,21.59 167,22.86 170.81,22.86 172.08,21.59 U3.GND 172.08,12.7 172.72,12.06 184.78,12.06 186.06,10.79 186.06,8.26 186.69,7.62 U$3.P$3
  Bottom 1.27: v201.3,19.69 201.3,21.59 201.93,22.23 203.96,22.23 U$14.IN-
  Bottom 1.676: U$8.OUT- 14.35,4.19 16.51,6.35 16.51,17.15 13.97,19.69 U$1.IN-
LD2
  Bottom 0.61: R7.2 236.22,41.27 240.03,45.09 240.03,46.99 243.84,46.99 247.65,50.8 247.65,60.32 247.01,60.96 WEMOS.J1.1
LD5  (via drill 0.7 pad 1.27)
  Top 0.61: v245.75,59.69 v245.75,62.23
  Bottom 0.61: R8.2 231.14,42.54 231.78,43.18 236.22,43.18 238.76,45.72 238.76,48.26 243.2,48.26 246.38,51.43 246.38,59.05 v245.75,59.69 | v245.75,62.23 245.75,62.86 245.11,63.5 WEMOS.J1.2
LD6
  Bottom 0.61: R9.2 226.06,43.18 227.33,44.45 235.58,44.45 237.49,46.35 237.49,48.89 238.12,49.53 242.57,49.53 245.11,52.07 245.11,58.42 244.48,59.05 241.3,59.05 240.67,59.69 240.67,62.86 239.39,64.14 238.76,64.14 238.12,64.77 238.12,70.48 238.76,71.12 WEMOS.J1.5
LD7  (via drill 0.7 pad 1.42)
  Top 0.61: v236.86,60.96 v236.86,64.77
  Bottom 0.61: U$6.RST 238.76,57.78 238.12,58.42 238.12,61.59 237.49,61.59 v236.86,60.96 | v236.86,64.77 236.86,72.39 238.12,73.66 WEMOS.J1.6
LMISO  (via drill 0.7 pad 1.42)
  Top 0.61: v208.28,57.15 v204.47,57.15
  Bottom 0.61: LORA.J1.1 146.69,78.74 167,58.42 203.2,58.42 v204.47,57.15 204.47,46.35 203.2,45.09 U$7.JP1.5 | v208.28,57.15 210.82,59.69 222.88,59.69 225.43,57.15 226.69,57.15 U$6.MISO
LMOSI  (via drill 0.7 pad 1.42)
  Top 0.61: v147.32,88.27 v147.32,82.55 | v208.28,59.69 v205.74,59.69
  Bottom 0.61: U$7.JP1.6 202.56,42.54 205.74,45.72 v205.74,59.69 205.74,60.32 203.83,62.23 201.3,62.23 200.03,60.96 168.28,60.96 147.32,81.92 v147.32,82.55 | LORA.J1.5 146.69,88.9 v147.32,88.27 | v208.28,59.69 209.55,60.96 223.52,60.96 226.06,58.42 227.97,58.42 U$6.MOSI
LSCK  (via drill 0.7 pad 1.42)
  Top 0.61: v202.56,56.52 v202.56,60.32 | v210.19,62.86 v210.19,55.24 | v208.92,47.62 v202.56,47.62
  Bottom 0.61: U$7.JP1.4 v202.56,47.62 203.2,48.26 203.2,55.88 v202.56,56.52 | v202.56,60.32 201.93,59.69 167.64,59.69 146.05,81.28 LORA.J1.2 | v210.19,62.86 210.82,62.23 224.16,62.23 226.69,59.69 229.24,59.69 U$6.SCK | v210.19,55.24 209.55,55.24 208.28,53.98 208.28,48.26 v208.92,47.62
LSS  (via drill 0.7 pad 1.42)
  Top 0.61: v149.86,88.27 v149.86,82.55
  Bottom 0.61: LORA.J1.6 146.69,91.44 v149.86,88.27 | v149.86,82.55 149.86,81.28 168.91,62.23 199.39,62.23 200.66,63.5 204.47,63.5 207.01,60.96 207.01,45.09 201.93,40 U$7.JP1.7
MISO
  Bottom 0.61: LORA.J2.1 133.35,78.74 133.99,78.11 133.99,76.2 135.25,74.93 146.69,74.93 162.56,59.05 U$3.P$77
MOSI  (via drill 0.7 pad 1.42)
  Top 0.61: v137.16,78.11 v137.16,73.03
  Bottom 0.61: LORA.J2.5 133.99,88.9 136.53,86.36 136.53,78.74 v137.16,78.11 | v137.16,73.03 137.8,73.66 146.05,73.66 161.29,58.42 161.29,54.61 U$3.P$78
N$1  (via drill 0.7 pad 1.27)
  Top 1.27: v26.67,36.83 v34.92,36.83
  Bottom 1.27: 34.92,19.69 28.58,19.69 26.67,21.59 v26.67,36.83 | v34.92,36.83 34.92,50.16 38.73,53.98 38.73,82.55
  Bottom 1.676: 38.73,82.55 37.47,83.82 36.83,84.45 U$2.GNDI | 34.92,19.69 U$1.OUT-
N$2
  Bottom 1.27: D1.C R1.1
N$3
  pour Bottom: 0,94.62 0,0 122.56,0 122.56,94.62
N$4
  Bottom 0.61: R11.2 236.22,79.38 237.49,80.65 240.08,80.65 PWR.3
N$5
  Bottom 0.813: F2.2 187.32,5.71 U$3.P$1
N$6
  Bottom 1.016: D3.C 182.54,5.92 F2.1
N$7
  Bottom 1.676: U$1.OUT+ 33.02,33.66 31.11,35.56 U$5.P1.1
N$8
  pour Bottom: 127.64,94.62 127.64,0 250.19,0 250.19,94.62
N$9  (via drill 0.7 pad 1.27)
  Top 1.676: v12.7,15.88 v19.69,15.88
  Bottom 1.676: U$8.OUT+ 10.67,15.11 11.43,15.88 v12.7,15.88 | v19.69,15.88 19.69,28.58 14.61,33.66 U$1.IN+
N$10
  Bottom 1.27: 52.7,21.59 50.8,23.5 48.9,23.5
N$11
  Bottom 1.27: 52.7,31.12 51.44,29.85 48.26,29.85
N$12
  Bottom 0.61: R12.2 241.89,82.55 PWR.4
N$13
  Bottom 0.61: STS.1 237.87,87.38 236.22,85.73 R13.2
N$14  (via drill 0.7 pad 1.42)
  Top 1.27: v8.25,55.24 v8.25,61.59
  Bottom 1.27: R1.2 v8.25,55.24 | v8.25,61.59 5.08,61.59 4.45,60.96 4.45,60.17 T1.B
N$15
  Bottom 1.27: T1.C 11.43,59.05 12.06,59.69 K1.1 12.06,63.5 11.09,64.48 D2.A
N$16
  Bottom 2.54: U$1.B+ 50.16,30.48 51.44,31.75
  Bottom 3.81: 51.44,31.75 U$9.+1 U$9.+2 U$9.+3 U$9.+4
N$17
  Bottom 2.54: U$1.B- 49.53,22.86 51.44,20.96
  Bottom 3.81: U$9.-4 U$9.-3 U$9.-2 U$9.-1 51.44,20.96
N$18  (via drill 0.7 pad 1.42)
  other vias: 225.94,4.74
N$19
  Bottom 0.61: STS.3 237.74,90.42 236.22,88.9 R14.2
N$20
  Bottom 0.61: R15.2 241.89,92.08 STS.4
N$22
  Bottom 1.27: K1.P2 19.69,70.48 15.88,74.3 U$2.VOUT
N$23
  Bottom 0.61: R7.1 236.22,36.2 235.58,35.56 233.05,35.56 231.14,33.66 U$6.DIO0
N$24
  Bottom 0.61: R8.1 231.14,36.2 230.5,35.56 229.24,35.56 228.6,34.92 U$6.DIO1
N$25
  Bottom 0.61: R9.1 U$6.DIO2
N$26  (via drill 0.7 pad 1.42)
  other vias: 228.45,4.74
N$27  (via drill 0.7 pad 1.42)
  other vias: 230.96,4.74
N$28  (via drill 0.7 pad 1.42)
  other vias: 233.45,4.75
N$29  (via drill 0.7 pad 1.42)
  other vias: 235.95,4.75
N$30  (via drill 0.7 pad 1.42)
  other vias: 238.45,4.74
N$31  (via drill 0.7 pad 1.42)
  other vias: 228.45,25.74
N$32  (via drill 0.7 pad 1.42)
  other vias: 230.94,25.74
N$33  (via drill 0.7 pad 1.42)
  other vias: 233.45,25.73
N$34  (via drill 0.7 pad 1.42)
  other vias: 235.95,25.75
N$35  (via drill 0.7 pad 1.42)
  other vias: 238.45,25.75
N$36  (via drill 0.7 pad 1.42)
  other vias: 240.95,25.74
N$37  (via drill 0.7 pad 1.42)
  other vias: 226.07,32.39
N$38  (via drill 0.7 pad 1.42)
  other vias: 228.6,32.39
N$39  (via drill 0.7 pad 1.42)
  other vias: 231.14,32.39
N$40  (via drill 0.7 pad 1.42)
  other vias: 233.68,32.38
N$41  (via drill 0.7 pad 1.42)
  other vias: 236.22,32.39
N$42  (via drill 0.7 pad 1.42)
  other vias: 238.76,32.39
N$43  (via drill 0.7 pad 1.42)
  other vias: 226.05,55.24
N$44  (via drill 0.7 pad 1.42)
  other vias: 228.6,55.25
N$45  (via drill 0.7 pad 1.42)
  other vias: 231.14,55.24
N$46  (via drill 0.7 pad 1.42)
  other vias: 233.68,55.25
N$47  (via drill 0.7 pad 1.42)
  other vias: 236.22,55.25
N$48  (via drill 0.7 pad 1.42)
  other vias: 238.75,55.25
N$49  (via drill 0.7 pad 1.42)
  other vias: 241.3,55.25
N$50  (via drill 0.7 pad 1.42)
  other vias: 243.85,55.25
N$51  (via drill 0.7 pad 1.42)
  other vias: 232.41,73.65
N$52  (via drill 0.7 pad 1.42)
  other vias: 242.56,73.65
N$53  (via drill 0.7 pad 1.42)
  other vias: 242.57,71.13
N$54  (via drill 0.7 pad 1.42)
  other vias: 242.57,68.57
N$55  (via drill 0.7 pad 1.42)
  other vias: 242.57,66.04
N$56  (via drill 0.7 pad 1.42)
  other vias: 242.58,63.52
N$57  (via drill 0.7 pad 1.42)
  other vias: 232.41,63.5
N$58  (via drill 0.7 pad 1.42)
  other vias: 232.41,66.03
N$59  (via drill 0.7 pad 1.42)
  other vias: 232.41,68.58
N$60  (via drill 0.7 pad 1.42)
  other vias: 232.41,71.13
N$61  (via drill 0.7 pad 1.42)
  other vias: 232.41,60.97
N$62  (via drill 0.7 pad 1.42)
  other vias: 242.58,60.98
N$63  (via drill 0.7 pad 1.42)
  other vias: 132.72,78.74
N$64  (via drill 0.7 pad 1.42)
  other vias: 142.88,78.74
N$65  (via drill 0.7 pad 1.42)
  other vias: 132.71,91.44
N$66  (via drill 0.7 pad 1.42)
  other vias: 132.72,88.9
N$67  (via drill 0.7 pad 1.42)
  other vias: 132.73,86.36
N$68  (via drill 0.7 pad 1.42)
  other vias: 132.72,83.82
N$69  (via drill 0.7 pad 1.42)
  other vias: 132.72,81.27
N$70  (via drill 0.7 pad 1.42)
  other vias: 142.86,81.27
N$71  (via drill 0.7 pad 1.42)
  other vias: 142.88,83.81
N$72  (via drill 0.7 pad 1.42)
  other vias: 142.88,86.36
N$73  (via drill 0.7 pad 1.42)
  other vias: 142.88,88.89
N$74  (via drill 0.7 pad 1.42)
  other vias: 142.87,91.44
N$75  (via drill 0.7 pad 1.42)
  other vias: 156.2,87.62
N$76  (via drill 0.7 pad 1.42)
  other vias: 156.22,85.06
N$77  (via drill 0.7 pad 1.42)
  other vias: 156.2,82.58
N$78  (via drill 0.7 pad 1.42)
  other vias: 156.2,80.01
N$79  (via drill 0.7 pad 1.42)
  other vias: 144.14,69.22
N$80  (via drill 0.7 pad 1.42)
  other vias: 144.16,66.69
N$81  (via drill 0.7 pad 1.42)
  other vias: 144.14,64.15
N$82  (via drill 0.7 pad 1.42)
  other vias: 144.16,61.61
N$83  (via drill 0.7 pad 1.42)
  other vias: 144.14,59.04
N$84  (via drill 0.7 pad 1.42)
  other vias: 144.15,56.49
N$85  (via drill 0.7 pad 1.42)
  other vias: 144.15,53.98
N$86  (via drill 0.7 pad 1.42)
  other vias: 144.14,51.43
N$87  (via drill 0.7 pad 1.42)
  other vias: 144.15,48.9
N$88  (via drill 0.7 pad 1.42)
  other vias: 144.13,46.36
N$89  (via drill 0.7 pad 1.42)
  other vias: 135.25,36.83
N$90  (via drill 0.7 pad 1.42)
  other vias: 137.8,36.84
N$91  (via drill 0.7 pad 1.42)
  other vias: 140.34,36.84
N$92  (via drill 0.7 pad 1.42)
  other vias: 142.86,36.84
N$93  (via drill 0.7 pad 1.42)
  other vias: 145.41,36.84
N$94  (via drill 0.7 pad 1.42)
  other vias: 165.1,53.35
N$95  (via drill 0.7 pad 1.42)
  other vias: 165.1,55.88
N$96  (via drill 0.7 pad 1.42)
  other vias: 162.56,55.88
N$97  (via drill 0.7 pad 1.42)
  other vias: 162.56,53.34
N$98  (via drill 0.7 pad 1.42)
  other vias: 190.5,55.89
N$99  (via drill 0.7 pad 1.42)
  other vias: 190.49,53.35
N$100  (via drill 0.7 pad 1.42)
  other vias: 190.51,50.81
N$101  (via drill 0.7 pad 1.42)
  other vias: 190.5,48.27
N$102  (via drill 0.7 pad 1.42)
  other vias: 190.5,45.73
N$103  (via drill 0.7 pad 1.42)
  other vias: 187.97,43.18
N$104  (via drill 0.7 pad 1.42)
  other vias: 190.5,43.18
N$105  (via drill 0.7 pad 1.42)
  other vias: 187.96,40.65
N$106  (via drill 0.7 pad 1.42)
  other vias: 190.5,40.65
N$107  (via drill 0.7 pad 1.42)
  other vias: 187.96,38.1
N$108  (via drill 0.7 pad 1.42)
  other vias: 190.49,38.1
N$109  (via drill 0.7 pad 1.42)
  other vias: 187.96,30.48
N$110  (via drill 0.7 pad 1.42)
  other vias: 187.96,25.4
N$111  (via drill 0.7 pad 1.42)
  other vias: 190.5,25.4
N$112  (via drill 0.7 pad 1.42)
  other vias: 190.49,22.86
N$113  (via drill 0.7 pad 1.42)
  other vias: 187.96,20.32
N$114  (via drill 0.7 pad 1.42)
  other vias: 190.5,20.32
N$115  (via drill 0.7 pad 1.42)
  other vias: 187.96,12.71
N$116  (via drill 0.7 pad 1.42)
  other vias: 187.96,10.16
N$117  (via drill 0.7 pad 1.42)
  other vias: 187.96,7.62
N$118  (via drill 0.7 pad 1.42)
  other vias: 190.49,7.62
N$119  (via drill 0.7 pad 1.42)
  other vias: 187.96,5.09
N$120  (via drill 0.7 pad 1.42)
  other vias: 190.49,5.09
N$121  (via drill 0.7 pad 1.42)
  other vias: 196.21,55.27
N$122  (via drill 0.7 pad 1.42)
  other vias: 196.21,52.72
N$123  (via drill 0.7 pad 1.42)
  other vias: 196.23,50.17
N$124  (via drill 0.7 pad 1.42)
  other vias: 196.21,47.64
N$125  (via drill 0.7 pad 1.42)
  other vias: 196.23,45.08
N$126  (via drill 0.7 pad 1.42)
  other vias: 196.21,42.55
N$127  (via drill 0.7 pad 1.42)
  other vias: 196.21,40.01
N$128  (via drill 0.7 pad 1.42)
  other vias: 196.22,37.46
N$129  (via drill 0.7 pad 1.42)
  other vias: 219.08,37.47
N$130  (via drill 0.7 pad 1.42)
  other vias: 219.08,40.01
N$131  (via drill 0.7 pad 1.42)
  other vias: 219.08,42.55
N$132  (via drill 0.7 pad 1.42)
  other vias: 219.08,45.09
N$133  (via drill 0.7 pad 1.42)
  other vias: 219.08,47.61
N$134  (via drill 0.7 pad 1.42)
  other vias: 219.09,50.17
N$135  (via drill 0.7 pad 1.42)
  other vias: 219.08,52.73
N$136  (via drill 0.7 pad 1.42)
  other vias: 219.11,55.24
N$137  (via drill 0.7 pad 1.42)
  other vias: 5.06,78.73
N$138  (via drill 0.7 pad 1.42)
  other vias: 5.04,81.28
N$139  (via drill 0.7 pad 1.42)
  other vias: 5.06,83.82
N$140  (via drill 0.7 pad 1.42)
  other vias: 5.69,46.99
N$141  (via drill 0.7 pad 1.42)
  other vias: 5.72,44.47
N$142  (via drill 0.7 pad 1.42)
  other vias: 5.71,41.9
N$143  (via drill 0.7 pad 1.42)
  other vias: 6.33,11.39
N$144  (via drill 0.7 pad 1.42)
  other vias: 6.34,8.9
N$145  (via drill 0.7 pad 1.42)
  other vias: 6.35,6.35
RX1
  Bottom 0.61: U$3.P$30 191.13,40.64 191.77,40 191.77,34.92 194.31,32.38 203.2,32.38 205.11,30.48 229.24,30.48 230.5,29.21 230.5,26.19 U$10.TX
RX2
  Bottom 0.61: U$3.P$28 190.5,37.46 189.87,36.83 152.4,36.83 151.76,36.2 151.76,32.38 151.13,31.75 140.97,31.75 140.34,32.38 GPS.3
SCK
  Bottom 0.61: U$3.P$79 165.1,58.42 147.32,76.2 135.89,76.2 135.25,76.84 135.25,80.01 133.99,81.28 LORA.J2.2
SCL  (via drill 0.7 pad 1.42)
  Top 0.61: v193.04,56.52 v193.04,71.76 | v168.91,48.26 v168.91,52.07 | v168.91,55.88 v168.91,66.68 | v165.74,71.76 v162.56,71.76
  Bottom 0.61: U$7.JP2.3 214,50.16 203.2,39.37 203.2,36.2 201.93,34.92 195.58,34.92 194.31,36.2 194.31,41.91 | U$3.P$32 193.04,43.18 194.31,41.91 | 194.31,41.91 194.31,55.24 v193.04,56.52 | v193.04,71.76 189.87,71.76 189.23,72.39 181.61,72.39 175.89,66.68 172.72,66.68 172.08,67.31 169.55,67.31 v168.91,66.68 168.28,66.68 165.1,69.85 165.1,71.12 v165.74,71.76 | J3.4 156.21,76.84 161.29,71.76 v162.56,71.76 | U$4.3 144.78,51.43 146.05,52.7 151.76,52.7 151.76,48.89 153.67,46.99 158.12,46.99 160.02,48.89 168.28,48.89 v168.91,48.26 | v168.91,52.07 v168.91,55.88
SDA  (via drill 0.7 pad 1.42)
  Top 0.61: v162.56,74.3 v165.74,74.3 | v167,69.85 v167,55.88
  Bottom 0.61: U$7.JP2.4 217.81,48.89 214.63,48.89 204.47,38.73 204.47,35.56 202.56,33.66 194.94,33.66 193.04,35.56 193.04,41.27 192.41,41.91 188.59,41.91 187.96,42.54 U$3.P$31 185.42,43.18 178.44,50.16 167,50.16 | U$4.4 152.4,53.98 153.03,53.34 153.03,50.16 153.67,49.53 158.75,49.53 159.38,50.16 167,50.16 | J3.3 156.84,82.55 158.12,81.28 158.12,76.84 160.66,74.3 v162.56,74.3 | v165.74,74.3 167,74.3 167.64,73.66 167.64,70.48 v167,69.85 | v167,55.88 167,50.16
SS  (via drill 0.7 pad 1.42)
  Top 0.61: v139.06,71.76 v139.06,78.11
  Bottom 0.61: U$3.P$80 165.1,52.07 164.47,51.43 159.38,51.43 158.75,52.07 158.75,59.05 145.41,72.39 139.7,72.39 v139.06,71.76 | v139.06,78.11 139.06,78.74 137.8,80.01 137.8,88.27 134.62,91.44 LORA.J2.6
TX1  (via drill 0.7 pad 1.42)
  Top 0.61: v186.06,40 v186.06,34.29
  Bottom 0.61: U$10.RX 233.45,24.54 233.05,24.13 225.43,24.13 224.79,24.77 224.79,27.94 223.52,29.21 204.47,29.21 202.56,31.12 194.31,31.12 191.13,34.29 v186.06,34.29 | U$3.P$29 186.69,40.64 v186.06,40
TX2
  Bottom 0.61: U$3.P$27 160.02,38.1 158.75,39.37 152.4,39.37 150.5,37.46 150.5,33.02 141.61,33.02 141.61,35.56 GPS.4
VCC  (via drill 0.7 pad 1.27, 0.7 pad 1.42)
  Top 0.813: v131.44,27.31 v144.15,27.31 | v144.15,17.15 v144.15,9.53 | v149.22,9.53 v153.03,9.53
  Top 1.016: v204.47,9.53 v194.31,9.53
  Bottom 0.813: J2.2 130.81,42.54 130.18,41.91 130.18,37.46 131.44,36.2 v131.44,27.31 131.44,24.13 C1.+ | v144.15,27.31 v144.15,17.15 | v144.15,9.53 v149.22,9.53
  Bottom 1.016: U$14.IN+ 204.34,9.65 v204.47,9.53 | v194.31,9.53 194.31,4.45 193.04,3.17 178.44,3.17 177.17,4.45 177.17,8.26 178.44,9.53 D3.A 172.72,9.53 170.81,9.53 | U3.IN 169.55,10.79 170.81,9.53 | v153.03,9.53 170.81,9.53
VCCIN
  Bottom 1.676: U$5.P1.2 31.11,53.34 33.66,55.88 33.66,74.3 U$2.VIN
VGSM
  Bottom 1.016: U$14.OUT+ 219.84,17.27 222.25,19.69 237.49,19.69 238.76,20.96 238.76,25.43 U$10.VCC
VIN  (via drill 0.7 pad 1.27, 0.7 pad 1.42)
  Top 1.016: v18.42,92.08 v30.48,92.08 | v35.56,87 v35.56,81.28 | v19.05,52.7 v24.77,52.7
  Bottom 1.016: 18.42,89.54 v18.42,92.08 | J1.2 3.81,8.89 2.54,10.16 2.54,35.56 3.81,36.83 15.88,36.83 20.32,41.27 20.32,51.43 v19.05,52.7 | v24.77,52.7 24.77,54.61 26.03,55.88 28.58,55.88 29.84,57.15 K1.S1
  Bottom 1.27: R4.1 R2.1 | K1.O2 24.77,66.68 29.84,61.59 K1.S1
  Bottom 1.422: R2.1 18.57,89.38 18.42,89.54 19.05,89.54 | v30.48,92.08 32.39,92.08 35.56,88.9 v35.56,87 | K1.O2 24.77,76.84 27.31,79.38 33.66,79.38 v35.56,81.28

### Text on the board
Bottom: 18650 Battery Holder
tNames: GND | I Gauge + | VCC | SDA | By: mantisID | SCL | USAID - | MAKEDONIA | PDAM TIRTA PAKUAN - BOGOR | GND | MISO | MOSI | SCK | NSS | RST | DIO5 | DIO2 | DIO1 | DIO0 | SD & RTC | 4.5V